# EAGLE design XPL-32 - Copy (EAGLE 9.6.0)
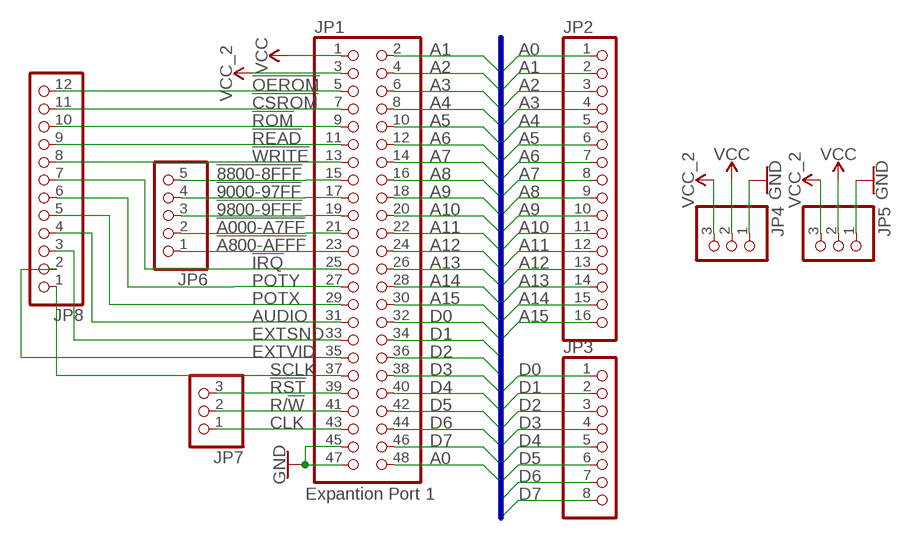
[diagram p0: schematic, sheet 1]

## Parts
JP1  PINHD-2X24/90  [2X24/90]
JP2  PINHD-1X16  [1X16]
JP3  PINHD-1X8  [1X08]
JP4  PINHD-1X3  [1X03]
JP5  PINHD-1X3  [1X03]
JP6  PINHD-1X5  [1X05]
JP7  PINHD-1X3  [1X03]
JP8  PINHD-1X12  [1X12]

## Nets
!8800-8FFF: JP1.15 JP6.5
!9000-97FF: JP1.17 JP6.4
!9800-9FFF: JP1.19 JP6.3
!A000-A7FF: JP1.21 JP6.2
!A800-AFFF: JP1.23 JP6.1
!CSROM: JP1.7 JP8.11
!IRQ: JP1.25 JP8.7
!OEROM: JP1.5 JP8.12
!READ: JP1.11 JP8.9
!ROM: JP1.9 JP8.10
!RST: JP1.39 JP7.3
!WRITE: JP1.13 JP8.8
A0: JP1.48 JP2.1
A1: JP1.2 JP2.2
A2: JP1.4 JP2.3
A3: JP1.6 JP2.4
A4: JP1.8 JP2.5
A5: JP1.10 JP2.6
A6: JP1.12 JP2.7
A7: JP1.14 JP2.8
A8: JP1.16 JP2.9
A9: JP1.18 JP2.10
A10: JP1.20 JP2.11
A11: JP1.22 JP2.12
A12: JP1.24 JP2.13
A13: JP1.26 JP2.14
A14: JP1.28 JP2.15
A15: JP1.30 JP2.16
AUDIO: JP1.31 JP8.4
CLK: JP1.43 JP7.1
D0: JP1.32 JP3.1
D1: JP1.34 JP3.2
D2: JP1.36 JP3.3
D3: JP1.38 JP3.4
D4: JP1.40 JP3.5
D5: JP1.42 JP3.6
D6: JP1.44 JP3.7
D7: JP1.46 JP3.8
EXTSND: JP1.33 JP8.3
EXTVID: JP1.35 JP8.2
GND: JP1.45 JP1.47 JP4.1 JP5.1
POTX: JP1.29 JP8.5
POTY: JP1.27 JP8.6
R/!W: JP1.41 JP7.2
SCLK: JP1.37 JP8.1
VCC: JP1.1 JP4.2 JP5.2
VCC_2: JP1.3 JP4.3 JP5.3

## Buses
BUS:A[0..15],D[0..7]

## Notes on the sheet
- Expantion Port 1

## Library data of the parts
JP1 = pinhead:PINHD-2X24: PIN HEADER
JP2 = pinhead:PINHD-1X16: PIN HEADER
JP3 = pinhead:PINHD-1X8: PIN HEADER
JP4 JP5 JP7 = pinhead:PINHD-1X3: PIN HEADER
JP6 = pinhead:PINHD-1X5: PIN HEADER
JP8 = pinhead:PINHD-1X12: PIN HEADER

## Board
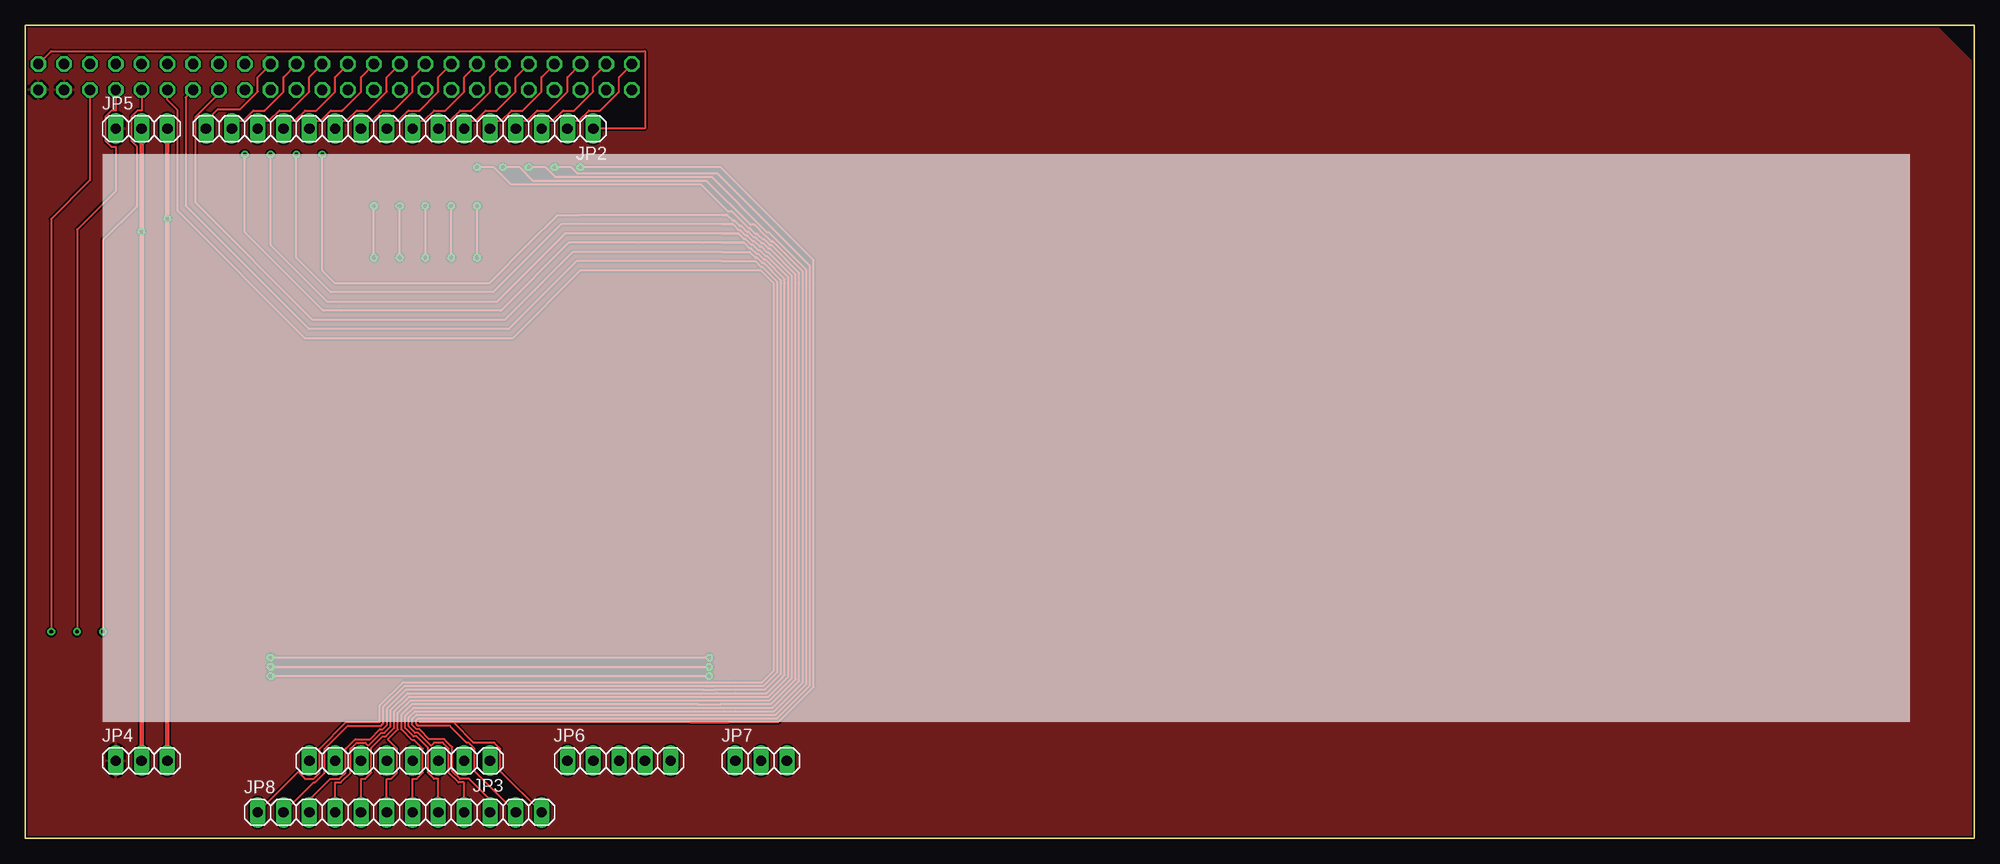
[diagram p1: board, top side]
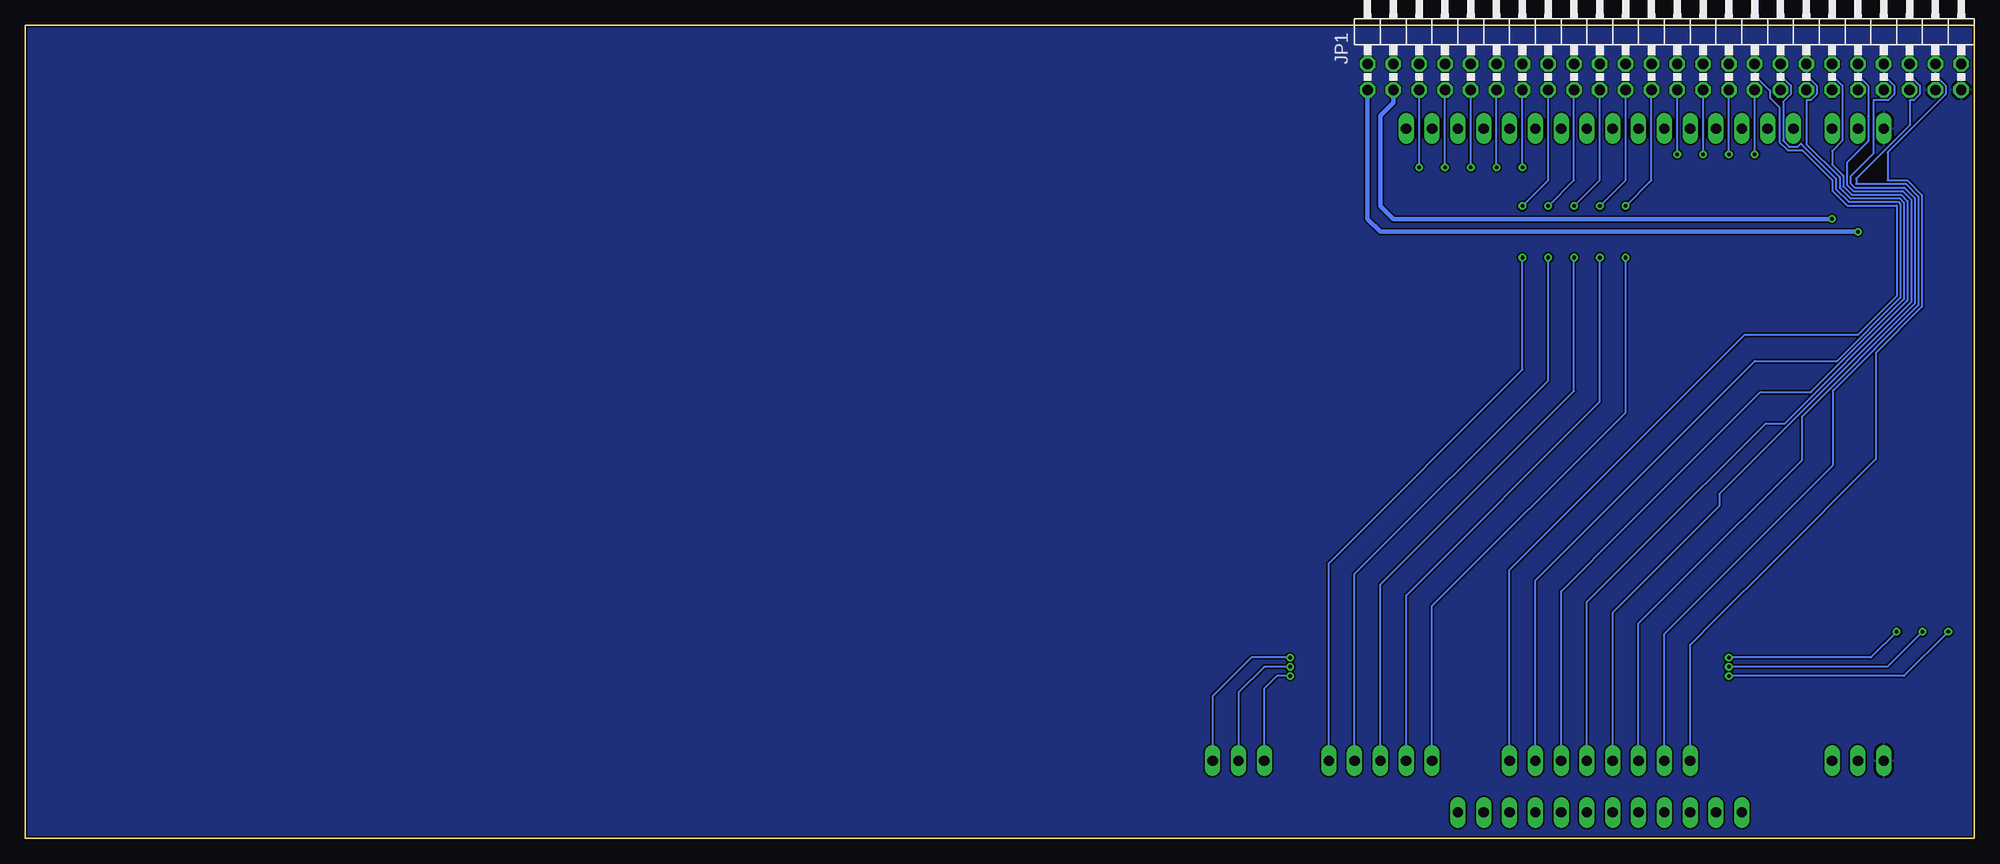
[diagram p2: board, bottom side, seen from below]

Size 191.77 x 80.01 mm. Coordinates in mm from the lower left corner, seen from the top.
Outline: 0,24.13 0,0 191.77,0 191.77,80.01 0,80.01 0,24.13
Copper layers (1*16): Top 0.035mm / dielectric 1.5mm / Bottom 0.035mm
Design rules "default *": minimum track width 8mil, minimum drill 0.35mm, track to track 6mil, track to pad 6mil, pad to pad 6mil, via to via 6mil, smd to smd 6mil, copper to edge 6mil, drill to drill 6mil, minimum pad ring 10mil, minimum via ring 8mil, stop-mask expansion 4mil, vias tented up to drill 0mil, thermal gap 10mil

### Footprints (pad centres in the part's own frame; a part is rotated, then mirrored left to right if it is on the bottom)
2X24/90 = drill 1.016 octagon: 1 -29.21,-6.35; 2 -29.21,-3.81; 3 -26.67,-6.35; 4 -26.67,-3.81; 5 -24.13,-6.35; 6 -24.13,-3.81; 7 -21.59,-6.35; 8 -21.59,-3.81; 9 -19.05,-6.35; 10 -19.05,-3.81; 11 -16.51,-6.35; 12 -16.51,-3.81; 13 -13.97,-6.35; 14 -13.97,-3.81; 15 -11.43,-6.35; 16 -11.43,-3.81; 17 -8.89,-6.35; 18 -8.89,-3.81; 19 -6.35,-6.35; 20 -6.35,-3.81; 21 -3.81,-6.35; 22 -3.81,-3.81; 23 -1.27,-6.35; 24 -1.27,-3.81; 25 1.27,-6.35; 26 1.27,-3.81; 27 3.81,-6.35; 28 3.81,-3.81; 29 6.35,-6.35; 30 6.35,-3.81; 31 8.89,-6.35; 32 8.89,-3.81; 33 11.43,-6.35; 34 11.43,-3.81; 35 13.97,-6.35; 36 13.97,-3.81; 37 16.51,-6.35; 38 16.51,-3.81; 39 19.05,-6.35; 40 19.05,-3.81; 41 21.59,-6.35; 42 21.59,-3.81; 43 24.13,-6.35; 44 24.13,-3.81; 45 26.67,-6.35; 46 26.67,-3.81; 47 29.21,-6.35; 48 29.21,-3.81
1X16 = drill 1.016 long: 1 -19.05,0; 2 -16.51,0; 3 -13.97,0; 4 -11.43,0; 5 -8.89,0; 6 -6.35,0; 7 -3.81,0; 8 -1.27,0; 9 1.27,0; 10 3.81,0; 11 6.35,0; 12 8.89,0; 13 11.43,0; 14 13.97,0; 15 16.51,0; 16 19.05,0
1X08 = drill 1.016 long: 1 -8.89,0; 2 -6.35,0; 3 -3.81,0; 4 -1.27,0; 5 1.27,0; 6 3.81,0; 7 6.35,0; 8 8.89,0
1X03 = drill 1.016 long: 1 -2.54,0; 2 0,0; 3 2.54,0
1X05 = drill 1.016 long: 1 -5.08,0; 2 -2.54,0; 3 0,0; 4 2.54,0; 5 5.08,0
1X12 = drill 1.016 long: 1 -13.97,0; 2 -11.43,0; 3 -8.89,0; 4 -6.35,0; 5 -3.81,0; 6 -1.27,0; 7 1.27,0; 8 3.81,0; 9 6.35,0; 10 8.89,0; 11 11.43,0; 12 13.97,0

### Placement (x,y rotation side)
JP1  30.48,80.01 0 bottom
JP2  36.83,69.85 180 top
JP3  36.83,7.62 180 top
JP4  11.43,7.62 0 top
JP5  11.43,69.85 0 top
JP6  58.42,7.62 0 top
JP7  72.39,7.62 0 top
JP8  36.83,2.54 0 top

### Tracks (layer width: path | path; a pad name or v marks a point on that pad's centre or on a via)
!8800-8FFF  (via drill 0.35)
  Top 0.203: v44.45,57.15 v44.45,62.23
  Bottom 0.203: JP6.5 63.5,27.07 44.45,46.12 v44.45,57.15 | JP1.15 41.91,64.77 v44.45,62.23
!9000-97FF  (via drill 0.35)
  Top 0.203: v41.91,57.15 v41.91,62.23
  Bottom 0.203: JP6.4 60.96,26.02 41.91,45.07 v41.91,57.15 | JP1.17 39.37,64.77 v41.91,62.23
!9800-9FFF  (via drill 0.35)
  Top 0.203: v39.37,57.15 v39.37,62.23
  Bottom 0.203: JP6.3 58.42,24.96 39.37,44.01 v39.37,57.15 | JP1.19 36.83,64.77 v39.37,62.23
!A000-A7FF  (via drill 0.35)
  Top 0.203: v36.83,57.15 v36.83,62.23
  Bottom 0.203: JP6.2 55.88,23.91 36.83,42.96 v36.83,57.15 | JP1.21 34.29,64.77 v36.83,62.23
!A800-AFFF  (via drill 0.35)
  Top 0.203: v34.29,57.15 v34.29,62.23
  Bottom 0.203: JP6.1 53.34,22.86 34.29,41.91 v34.29,57.15 | JP1.23 31.75,64.77 v34.29,62.23
!CSROM  (via drill 0.35)
  Top 0.203: JP8.11 44.2,6.6 44.2,8.8 43.6,9.4 43.44,9.4 41.76,11.07 38.64,11.07 38.43,11.28 38.43,11.43 38.43,11.58 38.64,11.79 65.56,11.79 65.58,11.77 69.05,11.77 69.06,11.79 69.85,11.79 73.97,11.79 76.17,13.99 77.22,15.04 77.22,54.61 77.22,56.33 68.14,65.41 54.35,65.41 53.72,66.04 v52.07,66.04
  Bottom 0.203: v52.07,66.04 JP1.7
!IRQ  (via drill 0.35)
  Top 0.203: JP8.7 38.1,5.84 38.52,5.84 39.12,6.44 39.12,8.8 38.27,9.65 38.05,9.65 37.01,10.69 37.01,11.43 37.01,12.17 38.05,13.21 66.15,13.21 66.16,13.2 68.46,13.2 68.47,13.21 69.85,13.21 73.38,13.21 75.17,15 75.79,15.63 75.79,54.61 75.79,55.49 73.27,58.01 73.13,58.01 72.57,58.57 72.43,58.57 71.87,59.12 71.72,59.12 71.17,59.67 71.02,59.67 70.47,60.23 70.33,60.23 69.77,60.78 69.62,60.78 69.07,61.33 | 68.58,61.33 69.07,61.33 | 69.07,61.33 54.61,61.33 52.35,61.33 49.48,58.47 45.67,54.66 30.43,54.66 29.21,55.88 v29.21,67.31
  Bottom 0.203: v29.21,67.31 JP1.25
!OEROM  (via drill 0.35)
  Top 0.203: JP8.12 46.74,6.6 46.74,8.8 46.14,9.4 44.1,9.4 42.07,11.43 38.79,11.43 65.42,11.43 65.43,11.42 69.19,11.42 69.2,11.43 69.85,11.43 74.11,11.43 76.43,13.74 77.57,14.89 77.57,54.61 77.57,56.88 68.42,66.04 v54.61,66.04
  Bottom 0.203: v54.61,66.04 JP1.5
!READ  (via drill 0.35)
  Top 0.203: JP8.9 43.18,5.42 43.11,5.49 42.61,5.49 41.66,6.44 41.66,8.8 41.06,9.4 40.22,9.4 39.91,9.09 38.64,10.36 38.34,10.36 37.72,10.99 37.72,11.43 37.72,11.87 38.34,12.5 65.86,12.5 65.87,12.49 68.75,12.49 68.76,12.5 69.85,12.5 73.67,12.5 75.67,14.5 76.5,15.33 76.5,54.61 76.5,55.79 73.57,58.72 73.42,58.72 72.87,59.28 72.86,59.28 71.75,60.38 71.35,60.38 67.03,64.7 49.98,64.7 48.64,66.04 v46.99,66.04
  Bottom 0.203: v46.99,66.04 JP1.11
!ROM  (via drill 0.35)
  Top 0.203: JP8.10 45.72,3.78 43.66,5.84 42.76,5.84 42.01,6.59 42.01,8.95 41.21,9.75 39.75,9.75 38.79,10.72 38.49,10.72 38.08,11.13 38.08,11.43 38.08,11.72 38.49,12.14 65.71,12.14 65.72,12.13 68.9,12.13 68.91,12.14 69.85,12.14 73.82,12.14 75.92,14.25 76.86,15.18 76.86,54.61 76.86,55.94 73.16,59.63 73.01,59.63 67.59,65.05 52.16,65.05 51.18,66.04 v49.53,66.04
  Bottom 0.203: v49.53,66.04 JP1.9
!RST  (via drill 0.35)
  Top 0.203: JP1.39 11.43,71.63 11.01,71.63 10.41,71.03 10.41,68.67 10.95,68.13 10.95,62.18 7.62,58.86 v7.62,20.32 | v24.13,17.78 v67.31,17.78
  Bottom 0.203: v7.62,20.32 10.16,17.78 v24.13,17.78 | v67.31,17.78 71.12,17.78 74.93,13.97 JP7.3
!WRITE  (via drill 0.35)
  Top 0.203: JP8.8 40.64,5.84 40.22,5.84 39.62,6.44 39.62,8.88 38.49,10.01 38.2,10.01 37.36,10.84 37.36,11.43 37.36,12.02 38.2,12.85 66.01,12.85 66.02,12.84 68.6,12.84 68.61,12.85 69.85,12.85 73.52,12.85 75.42,14.75 76.15,15.48 76.15,54.61 76.15,55.64 73.42,58.37 73.27,58.37 72.72,58.92 72.57,58.92 72.02,59.48 71.87,59.48 71.32,60.03 71.2,60.03 69.54,61.69 69.13,61.69 66.48,64.34 47.8,64.34 46.1,66.04 v44.45,66.04
  Bottom 0.203: v44.45,66.04 JP1.13
A0
  Top 0.203: 55.88,69.09 JP2.1 60.96,69.85 60.96,77.47 2.54,77.47 JP1.48
A1
  Top 0.203: JP1.2 58.42,74.93 58.42,73.49 56.55,71.63 55.46,71.63 54.44,70.61 53.34,70.61 JP2.2
A2
  Top 0.203: JP1.4 55.88,74.93 55.88,73.49 54.02,71.63 52.92,71.63 51.9,70.61 50.8,70.61 JP2.3
A3
  Top 0.203: JP1.6 53.34,74.93 53.34,73.49 51.47,71.63 50.38,71.63 49.36,70.61 48.26,70.61 JP2.4
A4
  Top 0.203: JP1.8 50.8,74.93 50.8,73.49 48.94,71.63 47.84,71.63 46.82,70.61 45.72,70.61 JP2.5
A5
  Top 0.203: JP1.10 48.26,74.93 48.26,73.49 46.39,71.63 45.3,71.63 44.28,70.61 43.18,70.61 JP2.6
A6
  Top 0.203: JP1.12 45.72,74.93 45.72,73.49 43.86,71.63 42.76,71.63 41.74,70.61 40.64,70.61 JP2.7
A7
  Top 0.203: JP1.14 43.18,74.93 43.18,73.49 41.31,71.63 40.22,71.63 39.2,70.61 38.1,70.61 JP2.8
A8
  Top 0.203: JP1.16 40.64,74.93 40.64,73.49 38.78,71.63 37.68,71.63 36.66,70.61 35.56,70.61 JP2.9
A9
  Top 0.203: JP1.18 38.1,74.93 38.1,73.49 36.23,71.63 35.14,71.63 34.12,70.61 33.02,70.61 JP2.10
A10
  Top 0.203: JP1.20 35.56,74.93 35.56,73.49 33.7,71.63 32.6,71.63 31.58,70.61 30.48,70.61 JP2.11
A11
  Top 0.203: JP1.22 33.02,74.93 33.02,73.49 31.15,71.63 30.06,71.63 29.04,70.61 27.94,70.61 JP2.12
A12
  Top 0.203: JP1.24 30.48,74.93 30.48,73.49 28.61,71.63 27.52,71.63 26.5,70.61 25.4,70.61 JP2.13
A13
  Top 0.203: JP1.26 27.94,74.93 27.94,73.49 26.07,71.63 24.98,71.63 23.96,70.61 22.86,70.61 JP2.14
A14
  Top 0.203: JP1.28 25.4,74.93 25.4,73.49 23.54,71.63 22.44,71.63 21.42,70.61 20.32,70.61 JP2.15
A15
  Top 0.203: JP1.30 22.86,74.93 22.86,73.49 21.12,71.75 18.92,71.75 17.78,70.61 JP2.16
AUDIO  (via drill 0.35)
  Top 0.203: JP8.4 30.48,5.49 31.05,5.49 32,6.44 32,8.8 32.6,9.4 33.44,9.4 33.75,9.09 35.02,10.36 35.32,10.36 35.94,10.99 35.94,11.43 35.94,12.61 37.61,14.28 66.59,14.28 66.61,14.26 68.01,14.26 68.02,14.28 69.85,14.28 72.93,14.28 74.41,15.76 74.73,16.07 74.73,54.61 74.73,55.05 72.83,56.95 72.69,56.95 72.13,57.5 71.98,57.5 71.43,58.05 71.28,58.05 70.73,58.61 | 68.58,58.61 70.73,58.61 | 70.73,58.61 66.67,58.61 60.33,58.61 53.48,58.61 46.8,51.93 31.11,51.93 | 31.11,51.93 29.31,51.93 21.59,59.64 v21.59,67.31 | 31.11,51.93
  Bottom 0.203: v21.59,67.31 JP1.31
CLK  (via drill 0.35)
  Top 0.203: JP1.43 6.35,64.77 2.54,60.96 v2.54,20.32 | v24.13,15.96 v67.31,15.96
  Bottom 0.203: v2.54,20.32 6.9,15.96 v24.13,15.96 | JP7.1 69.85,14.73 68.62,15.96 v67.31,15.96
D0
  Bottom 0.203: JP3.1 45.72,26.42 37.97,34.16 32.26,39.88 22.61,49.53 11.43,49.53 7.62,53.34 7.62,62.28 12.49,62.28 13.95,63.74 13.95,64.77 16.89,67.72 18.35,67.72 19.15,68.52 19.15,71.96 20.09,72.9 20.09,73.6 21.17,74.68 21.59,74.68 JP1.32
D1
  Bottom 0.203: JP3.2 43.18,25.36 36.18,32.37 21.57,46.97 13.49,46.97 7.26,53.19 7.26,62.43 7.47,62.64 12.34,62.64 13.59,63.89 13.59,64.92 17.05,68.38 17.36,68.07 18.2,68.07 18.8,68.67 18.8,72.48 18.03,73.24 18.03,74.08 18.63,74.68 19.05,74.68 JP1.34
D2
  Bottom 0.203: JP3.3 40.64,24.31 34.38,30.57 21.04,43.91 16.05,43.91 6.91,53.04 6.91,62.58 7.32,62.99 12.19,62.99 13.23,64.03 13.23,65.06 16.51,68.34 16.51,72.64 16.09,72.64 15.49,73.24 15.49,74.08 16.09,74.68 16.51,74.68 JP1.36
D3
  Bottom 0.203: JP3.4 38.1,23.26 32.58,28.77 20.52,40.84 18.61,40.84 6.55,52.9 6.55,62.72 7.18,63.35 12.05,63.35 12.88,64.18 12.88,65.21 13.97,66.3 13.97,67.65 12.95,68.67 12.95,71.03 12.95,74.08 13.55,74.68 13.97,74.68 JP1.38
D4
  Bottom 0.203: JP3.5 35.56,22.21 30.79,26.98 25.07,32.69 25.07,33.88 6.2,52.75 6.2,62.87 7.03,63.7 11.9,63.7 12.52,64.33 12.52,66.48 10.41,68.59 10.41,71.03 10.41,74.08 11.01,74.68 11.43,74.68 JP1.40
D5
  Bottom 0.203: JP3.6 33.02,21.15 28.99,25.18 16.93,37.25 16.93,41.52 5.84,52.6 5.84,63.02 6.88,64.06 11.75,64.06 12.17,64.47 12.17,65.14 9.91,67.4 9.91,72.64 8.47,72.64 7.87,73.24 7.87,74.08 8.47,74.68 8.89,74.68 JP1.42
D6
  Bottom 0.203: JP3.7 30.48,20.1 27.2,23.39 13.86,36.72 13.86,44.08 5.49,52.46 5.49,63.16 6.74,64.41 11.6,64.41 11.6,64.94 6.35,70.19 6.35,72.64 5.93,72.64 5.33,73.24 5.33,74.08 5.93,74.68 6.35,74.68 JP1.44
D7
  Bottom 0.203: JP3.8 27.94,19.05 25.4,21.59 19.68,27.3 9.67,37.32 9.67,47.77 5.13,52.31 5.13,63.31 6.59,64.77 8.51,64.77 8.51,67.52 2.79,73.24 2.79,74.08 3.39,74.68 3.81,74.68 JP1.46
EXTSND
  Top 0.203: JP8.3 27.94,3.78 30,5.84 30.9,5.84 31.5,6.44 31.5,8.8 32.45,9.75 33.91,9.75 34.87,10.72 35.17,10.72 35.58,11.13 35.58,11.43 35.58,12.76 37.46,14.63 66.74,14.63 66.75,14.62 67.87,14.62 67.88,14.63 69.85,14.63 72.79,14.63 74.16,16.01 74.37,16.21 74.37,54.61 74.37,54.91 72.69,56.59 72.54,56.59 71.98,57.14 71.84,57.14 71.28,57.7 68.58,57.7 53.86,57.7 47.18,51.02 28.29,51.02 16.76,62.55 16.76,71.03 19.05,73.32 JP1.33
EXTVID
  Top 0.203: JP8.2 28.35,5.49 28.51,5.49 29.46,6.44 29.46,8.8 31.74,11.07 35.02,11.07 35.23,11.28 35.23,11.43 35.23,12.9 37.31,14.99 66.89,14.99 66.9,14.97 67.72,14.97 67.73,14.99 69.85,14.99 72.64,14.99 73.91,16.26 74.02,16.36 74.02,54.61 74.02,54.76 72.54,56.24 72.39,56.24 71.84,56.79 68.58,56.79 54.23,56.79 47.56,50.11 27.92,50.11 15.77,62.25 15.77,72.92 JP1.35
GND
  pour Top: 0,80.01 0,0 191.77,0 191.77,76.2 187.96,80.01
  pour Bottom: 0,80.01 0,0 191.77,0 191.77,80.01
POTX  (via drill 0.35)
  Top 0.203: JP8.5 33.02,5.84 33.44,5.84 34.04,6.44 34.04,8.88 35.17,10.01 35.46,10.01 36.3,10.84 36.3,11.43 36.3,12.46 37.75,13.92 66.45,13.92 66.46,13.91 68.16,13.91 68.17,13.92 69.85,13.92 73.08,13.92 74.67,15.5 75.08,15.92 75.08,54.61 75.08,55.2 72.98,57.3 72.83,57.3 72.28,57.86 72.13,57.86 71.58,58.41 71.43,58.41 70.88,58.96 70.73,58.96 70.18,59.52 | 68.58,59.52 70.18,59.52 | 70.18,59.52 53.1,59.52 46.43,52.84 29.68,52.84 24.13,58.39 v24.13,67.31
  Bottom 0.203: v24.13,67.31 JP1.29
POTY  (via drill 0.35)
  Top 0.203: JP8.6 35.56,5.84 35.98,5.84 36.58,6.44 36.58,8.8 35.67,9.71 36.65,10.69 36.65,11.43 36.65,12.31 37.9,13.56 66.3,13.56 66.31,13.55 68.31,13.55 68.32,13.56 69.85,13.56 73.23,13.56 74.92,15.25 75.44,15.77 75.44,54.61 75.44,55.35 73.13,57.66 72.98,57.66 72.43,58.21 72.28,58.21 71.72,58.76 71.58,58.76 71.02,59.32 70.88,59.32 70.33,59.87 70.18,59.87 69.62,60.42 | 68.58,60.42 69.62,60.42 | 69.62,60.42 52.73,60.42 46.05,53.75 30.06,53.75 26.67,57.13 v26.67,67.31
  Bottom 0.203: v26.67,67.31 JP1.27
R/!W  (via drill 0.35)
  Top 0.203: JP1.41 8.89,71.63 8.47,71.63 7.87,71.03 7.87,68.67 8.47,68.07 8.89,68.07 8.89,63.72 5.08,59.91 v5.08,20.32 | v24.13,16.87 v67.31,16.87
  Bottom 0.203: v5.08,20.32 8.53,16.87 v24.13,16.87 | v67.31,16.87 69.85,16.87 72.39,14.33 JP7.2
SCLK
  Top 0.203: JP8.1 26.84,6.52 27.52,5.84 28.36,5.84 28.96,6.44 28.96,8.8 31.59,11.43 34.87,11.43 34.87,13.05 37.17,15.34 67.04,15.34 67.05,15.33 67.57,15.33 67.58,15.34 69.85,15.34 72.49,15.34 73.66,16.51 73.66,54.61 72.39,55.88 68.58,55.88 54.61,55.88 47.93,49.2 27.54,49.2 14.99,61.76 14.99,71.67 13.97,72.68 JP1.37
VCC  (via drill 0.35)
  Top 0.457: JP4.2 v11.43,59.69 JP5.2
  Bottom 0.457: v11.43,59.69 58.42,59.69 59.69,60.96 JP1.1
VCC_2  (via drill 0.35)
  Top 0.457: JP4.3 v13.97,60.96 JP5.3
  Bottom 0.457: v13.97,60.96 57.15,60.96 58.42,62.23 58.42,71.12 57.15,72.39 JP1.3